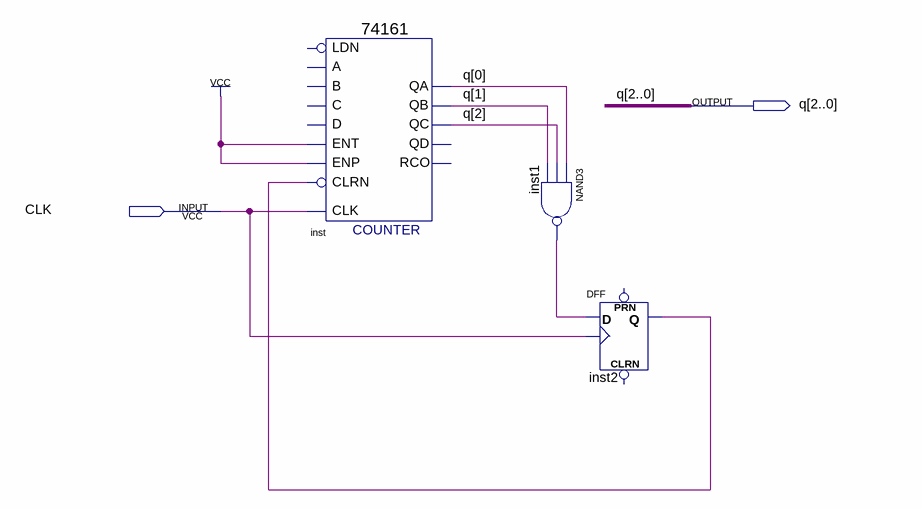
[diagram p0: schematic sheet]
// Quartus schematic count8.bdf as structural Verilog: 3 symbols, 2 pins
module count8 (
  input  CLK,
  output [2:0] q
);

  wire inst1_out, inst2_q;

  \74161  inst (
    .CLRN(inst2_q), .CLK(CLK), .ENP(1'b1), .ENT(1'b1), .QC(q[2]), .QB(q[1]), .QA(q[0]));  // open: LDN, A, D, B, C, QD, RCO
  nand inst1 (inst1_out, q[0], q[2], q[1]);
  DFF inst2 (.CLK(CLK), .D(inst1_out), .Q(inst2_q));  // open: CLRN, PRN
endmodule
